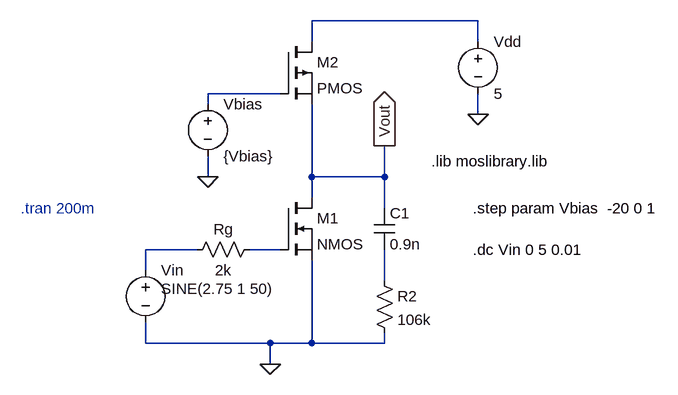
[diagram p0: schematic Q1[1].asc]
Q1[1].asc, the LTspice schematic file:
Version 4
SHEET 1 936 680
WIRE 544 -208 288 -208
WIRE 288 -176 288 -208
WIRE 544 -176 544 -208
WIRE 240 -96 128 -96
WIRE 128 -80 128 -96
WIRE 544 -64 544 -96
WIRE 128 32 128 0
WIRE 288 32 288 -80
WIRE 400 32 400 -16
WIRE 400 32 288 32
WIRE 288 64 288 32
WIRE 400 80 400 32
WIRE 112 144 32 144
WIRE 240 144 192 144
WIRE 32 176 32 144
WIRE 400 192 400 144
WIRE 32 288 32 256
WIRE 224 288 32 288
WIRE 288 288 288 160
WIRE 288 288 224 288
WIRE 400 288 400 272
WIRE 400 288 288 288
WIRE 224 320 224 288
FLAG 224 320 0
FLAG 128 32 0
FLAG 544 -64 0
FLAG 400 -16 Vout
IOPIN 400 -16 Out
SYMBOL res 384 176 R0
SYMATTR InstName R2
SYMATTR Value 106k
SYMBOL cap 384 80 R0
SYMATTR InstName C1
SYMATTR Value 0.9n
SYMBOL voltage 32 160 R0
WINDOW 3 24 44 Left 2
WINDOW 123 0 0 Left 0
WINDOW 39 0 0 Left 0
SYMATTR Value SINE(2.75 1 50)
SYMATTR InstName Vin
SYMBOL res 96 160 R270
WINDOW 0 32 56 VTop 2
WINDOW 3 0 56 VBottom 2
SYMATTR InstName Rg
SYMATTR Value 2k
SYMBOL pmos 240 -176 R0
SYMATTR InstName M2
SYMBOL voltage 544 -192 R0
SYMATTR InstName Vdd
SYMATTR Value 5
SYMBOL voltage 128 -96 R0
SYMATTR InstName Vbias
SYMATTR Value {Vbias}
SYMBOL nmos 240 64 R0
SYMATTR InstName M1
TEXT 472 8 Left 2 !.lib moslibrary.lib
TEXT 536 80 Left 2 !.step param Vbias  -20 0 1
TEXT 536 144 Left 2 !.dc Vin 0 5 0.01
TEXT -160 80 Left 2 ;.tran 200m

The netlist it stands for:
* Q1[1].asc
R2 N005 0 106k
C1 Vout N005 0.9n
Vin N003 0 SINE(2.75 1 50)
Rg N003 N004 2k
M2 N001 N002 Vout Vout PMOS
Vdd N001 0 5
Vbias N002 0 {Vbias}
M1 Vout N004 0 0 NMOS
.model NMOS NMOS
.model PMOS PMOS
.lib standard.mos
.lib moslibrary.lib
.step param Vbias  -20 0 1
.dc Vin 0 5 0.01
* .tran 200m
.backanno
.end